# EAGLE schematic flex-sensor-amplifier-hookup (EAGLE 6.5.0)
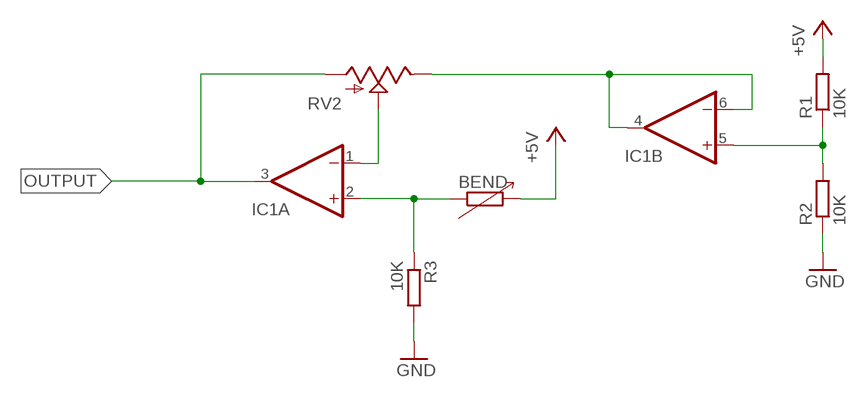
[diagram p0: schematic, sheet 1]

## Parts
BEND  R-EU_0204/7  [0204/7]
IC1  4AMP_P11+7N  [DIL14]
R1  10K  R-EU_0204/7  [0204/7]
R2  10K  R-EU_0204/7  [0204/7]
R3  10K  R-EU_0204/7  [0204/7]
RV2  POT  [ALPS_POT]

## Nets
+5V: BEND.2 R1.2
GND: R2.1 R3.2
N$1: IC1.5(B:+IN) R1.1 R2.2
N$2: BEND.1 IC1.2(A:+IN) R3.1
N$3: IC1.4(B:OUT) IC1.6(B:-IN) RV2.P$1(E)
N$4: IC1.1(A:-IN) RV2.P$2(S)
OUTPUT: IC1.3(A:OUT) RV2.P$3(A)
Unconnected: IC1.8(C:-IN) IC1.9(C:+IN) IC1.10(C:OUT) IC1.12(D:OUT) IC1.13(D:+IN) IC1.14(D:-IN)

## Power pins joined to a net without a drawn wire
V+: IC1.11(P:V+)
V-: IC1.7(P:V-)

## Library data of the parts
BEND R1-R3 = resistor:R-EU_: RESISTOR, European symbol
IC1 = linear:4AMP_P11+7: OP AMP
RV2 = SparkFun-Electromechanical:POT